# EAGLE design displayBoard (EAGLE 5.11)
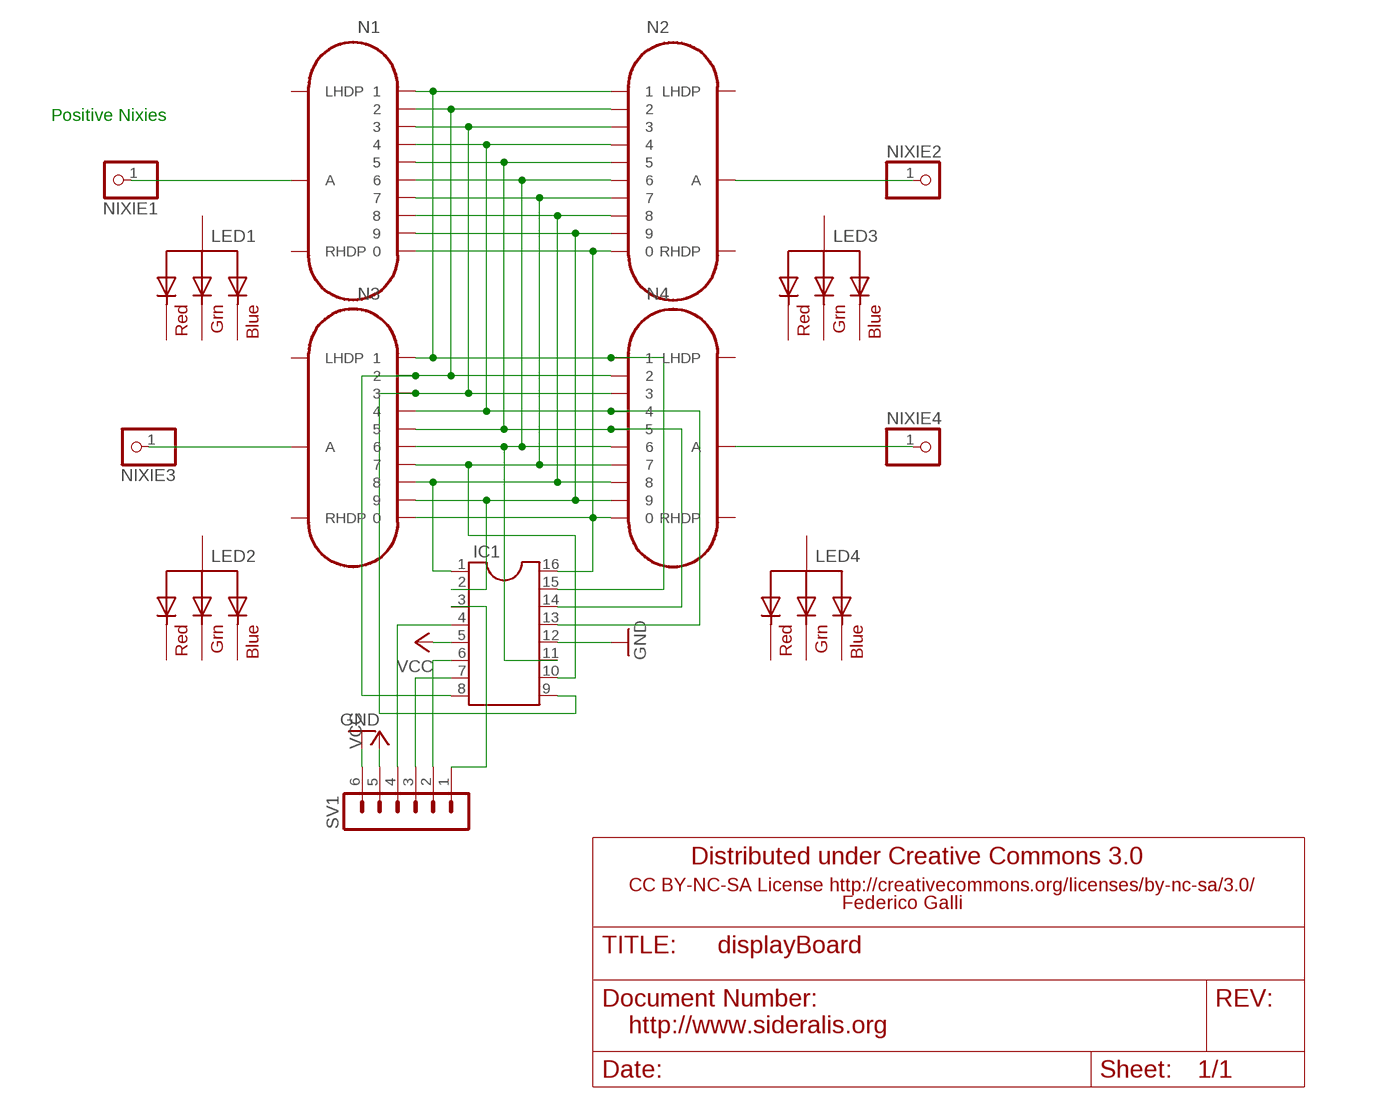
[diagram p0: schematic, sheet 1]

## Parts
IC1  DIL16  [DIL16]
LED1  RGBLED_CA-5MM  [LED5MMRGB]
LED2  RGBLED_CA-5MM  [LED5MMRGB]
LED3  RGBLED_CA-5MM  [LED5MMRGB]
LED4  RGBLED_CA-5MM  [LED5MMRGB]
N1  IN-14  [IN-14]
N2  IN-14  [IN-14]
N3  IN-14  [IN-14]
N4  IN-14  [IN-14]
NIXIE1  PINHD-1X1  [1X01]
NIXIE2  PINHD-1X1  [1X01]
NIXIE3  PINHD-1X1  [1X01]
NIXIE4  PINHD-1X1  [1X01]
SV1  MA06-1  [MA06-1]

## Nets
GND: IC1.12 SV1.6
N$1: IC1.2 N1.9 N2.9 N3.9 N4.9
N$2: IC1.15 N1.1 N2.1 N3.1 N4.1
N$6: N3.A NIXIE3.1
N$12: IC1.8 N1.2 N2.2 N3.2 N4.2
N$13: IC1.9 N1.3 N2.3 N3.3 N4.3
N$14: IC1.13 N1.4 N2.4 N3.4 N4.4
N$15: IC1.14 N1.5 N2.5 N3.5 N4.5
N$16: IC1.11 N1.6 N2.6 N3.6 N4.6
N$17: IC1.10 N1.7 N2.7 N3.7 N4.7
N$18: IC1.1 N1.8 N2.8 N3.8 N4.8
N$20: IC1.16 N1.0 N2.0 N3.0 N4.0
N$21: N1.A NIXIE1.1
N$31: N2.A NIXIE2.1
N$32: N4.A NIXIE4.1
N$35: IC1.3 SV1.1
N$36: IC1.6 SV1.2
N$37: IC1.7 SV1.3
N$38: IC1.4 SV1.4
VCC: IC1.5 SV1.5
Unconnected: LED1.1(RED) LED1.2(VCC) LED1.3(GREEN) LED1.4(BLUE) LED2.1(RED) LED2.2(VCC) LED2.3(GREEN) LED2.4(BLUE) LED3.1(RED) LED3.2(VCC) LED3.3(GREEN) LED3.4(BLUE) LED4.1(RED) LED4.2(VCC) LED4.3(GREEN) LED4.4(BLUE) N1.LHDP N1.RHDP N2.LHDP N2.RHDP N3.LHDP N3.RHDP N4.LHDP N4.RHDP

## Notes on the sheet
- Positive Nixies
- Distributed under Creative Commons 3.0
- CC BY-NC-SA License http://creativecommons.org/licenses/by-nc-sa/3.0/
- Federico Galli
- http://www.sideralis.org

## Library data of the parts
IC1 = ic-package:DIL16: Dual In Line / Socket
LED1-LED4 = adafruit:RGBLED_CA: RGB LED, common-anode 5MM Staggered pins 5mm Piranha package http://www.ladyada.net/library/pcb/eaglelibrary.html
N1-N4 = russian-nixies:IN-14: IN-14: medium numeric frontview nixie tube
NIXIE1-NIXIE4 = pinhead:PINHD-1X1: PIN HEADER
SV1 = con-lstb:MA06-1: PIN HEADER; OC_FARNELL: unknown; OC_NEWARK: unknown

## Net classes
0 default: width 0.051 mm, drill 0.051 mm, clearance 0.051 mm

## Board
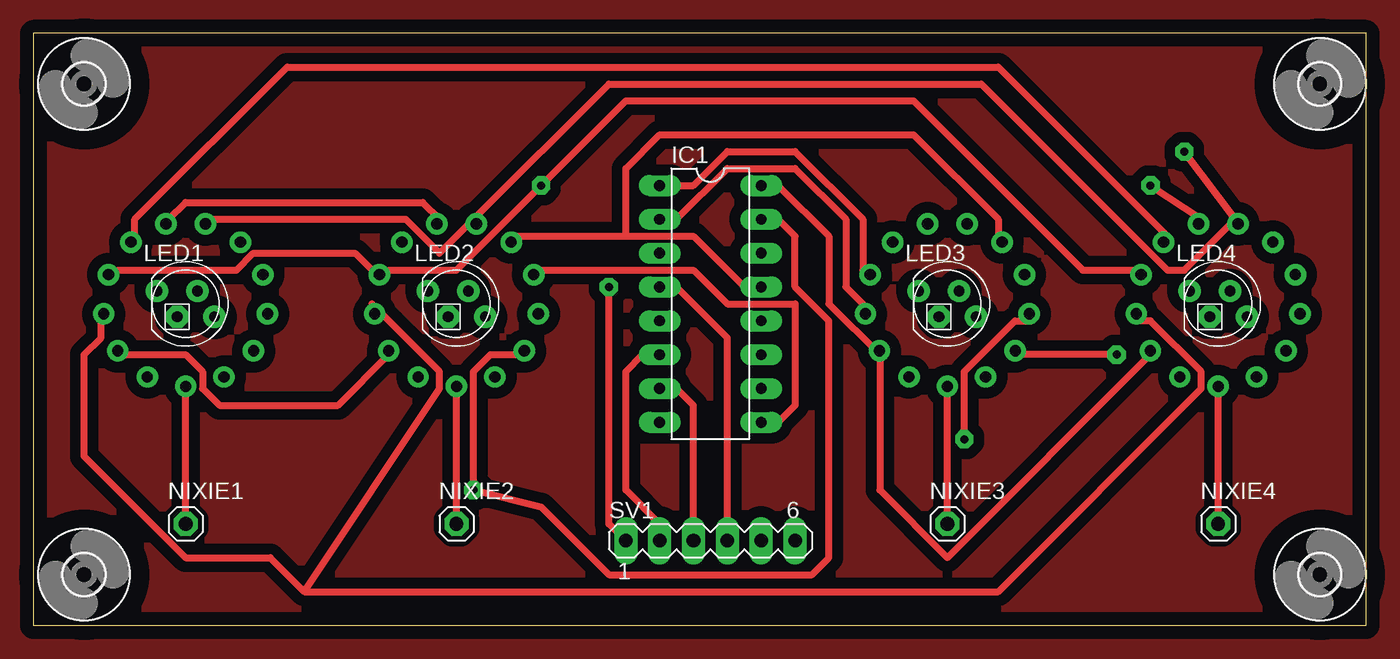
[diagram p1: board, top side]
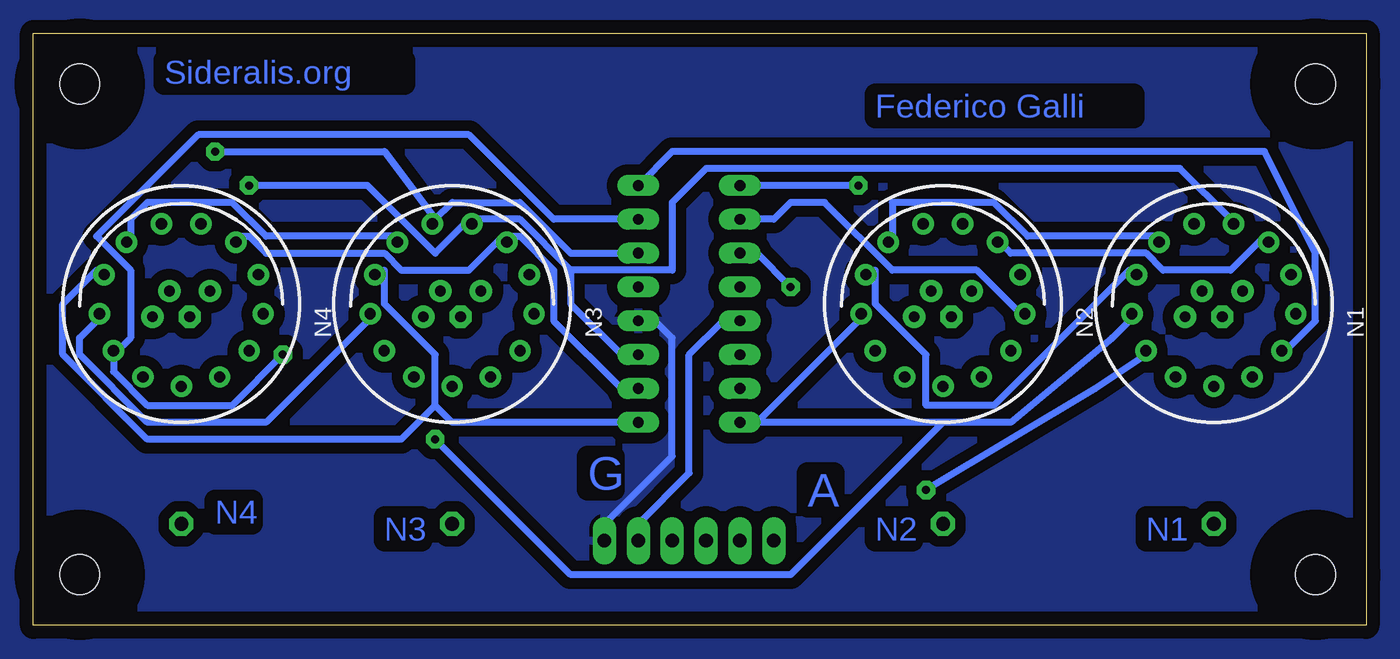
[diagram p2: board, bottom side, seen from below]

Size 100 x 44.44 mm. Coordinates in mm from the lower left corner, seen from the top.
Outline: 0,0 100,0 100,44.44 0,44.44 0,0
Copper layers (1*16): Top 0.035mm / dielectric 1.5mm / Bottom 0.035mm
Design rules "default *": minimum track width 20mil, minimum drill 24mil, track to track 8mil, track to pad 8mil, pad to pad 8mil, via to via 8mil, smd to smd 8mil, copper to edge 40mil, drill to drill 8mil, minimum pad ring 15mil, minimum via ring 15mil, stop-mask expansion 4mil, vias tented up to drill 0mil, thermal gap 10mil

### Footprints (pad centres in the part's own frame; a part is rotated, then mirrored left to right if it is on the bottom)
DIL16 = drill 0.813 long: 1 -8.89,-3.81; 2 -6.35,-3.81; 3 -3.81,-3.81; 4 -1.27,-3.81; 5 1.27,-3.81; 6 3.81,-3.81; 7 6.35,-3.81; 8 8.89,-3.81; 9 8.89,3.81; 10 6.35,3.81; 11 3.81,3.81; 12 1.27,3.81; 13 -1.27,3.81; 14 -3.81,3.81; 15 -6.35,3.81; 16 -8.89,3.81
LED5MMRGB = drill 0.8 pad 1.676 round: 1 -2.159,0.968; 3 0.889,0.968; 4 2.159,-0.968 | drill 0.8 pad 1.676 octagon: 2 -0.635,-0.968
IN-14 = drill 0.84 round: 0 5.094,-3.516; 1 -5.094,-3.516; 2 -6.145,-0.746; 3 -5.788,2.195; 4 -4.105,4.633; 5 -1.481,6.01; 6 1.481,6.01; 7 4.105,4.633; 8 5.788,2.195; 9 6.145,-0.746; A 0,-6.19; LHDP 2.877,-5.481; RHDP -2.877,-5.481
1X01 = drill 1.016 octagon: 1 0,0
MA06-1 = drill 1.016 long: 1 -6.35,0; 2 -3.81,0; 3 -1.27,0; 4 1.27,0; 5 3.81,0; 6 6.35,0
3,0 = hole 3: 0,0

### Placement (x,y rotation side)
IC1  50.8,24.13 270 top
LED1  11.43,24.13 0 top
LED2  31.75,24.13 0 top
LED3  68.58,24.13 0 top
LED4  88.9,24.13 0 top
N1  11.43,24.13 0 bottom
N2  31.75,24.13 0 bottom
N3  68.58,24.13 0 bottom
N4  88.9,24.13 0 bottom
NIXIE1  11.43,7.62 0 top
NIXIE2  31.75,7.62 0 top
NIXIE3  68.58,7.62 0 top
NIXIE4  88.9,7.62 0 top
SV1  50.8,6.35 0 top
U$1  [3,0]  3.81,40.64 0 top
U$2  [3,0]  96.52,40.64 0 top
U$3  [3,0]  96.52,3.81 0 top
U$4  [3,0]  3.81,3.81 0 top

### Tracks (layer width: path | path; a pad name or v marks a point on that pad's centre or on a via)
BOTTOM
  pour Bottom (isolate 0.813): -3.81,49.53 104.14,49.53 104.14,45.72 104.14,-6.35 -3.81,-6.35
GND
  Bottom 0.508: IC1.12 53.34,22.86 52.07,21.59 52.07,12.7 57.15,7.62 SV1.6
  pour Bottom (isolate 0.813): -2.54,49.53 102.87,48.26 102.87,-5.08 -2.54,-6.35
N$1
  Top 0.508: IC1.2 48.26,30.48 52.07,34.29 57.15,34.29 60.96,30.48 60.96,25.4 62.23,24.13 N3.9 | 20.32,2.54 30.48,17.78 30.48,19.05 25.4,24.13 N2.9 | 20.32,2.54 17.78,5.08 11.43,5.08 3.81,12.7 3.81,20.32 5.08,21.59 5.08,22.86 N1.9 | 20.32,2.54 72.39,2.54 87.63,17.78 87.63,19.05 83.82,22.86 82.55,22.86 N4.9
  Bottom 0.508: IC1.2 44.45,30.48 43.18,31.75 40.64,31.75 35.56,26.67 29.21,26.67 25.4,22.86 N2.9
N$2  (via drill 0.61)
  Top 0.508: N2.1 36.83,20.32 34.29,20.32 33.02,19.05 v33.02,10.16 38.1,8.89 43.18,3.81 58.42,3.81 59.69,5.08 59.69,22.86 57.15,25.4 57.15,29.21 55.88,30.48 IC1.15 | v81.28,20.32 73.66,20.32 N3.1
  Bottom 0.508: v33.02,10.16 20.32,17.78 16.51,20.32 N1.1 | IC1.15 60.96,30.48 67.31,36.83 87.63,36.83 95.25,29.21 92.71,26.67 92.71,21.59 93.98,20.32 | v81.28,20.32 85.09,16.51 91.44,16.51 93.98,19.05 93.98,20.32 | 93.98,20.32 N4.1
N$6
  Top 0.508: NIXIE3.1 N3.A
N$12  (via drill 0.61)
  Top 0.508: v69.85,13.97 69.85,19.05 73.66,22.86 74.93,22.86 N3.2
  Bottom 0.508: N3.2 74.93,22.86 82.55,15.24 91.44,15.24 96.52,20.32 96.52,21.59 95.25,22.86 N4.2 | 45.72,15.24 38.1,22.86 N2.2 | 31.75,15.24 45.72,15.24 | 31.75,15.24 26.67,15.24 19.05,21.59 17.78,22.86 N1.2 | 45.72,15.24 IC1.8 | v69.85,13.97 59.69,3.81 43.18,3.81 31.75,15.24
N$13
  Top 0.508: IC1.9 55.88,15.24 57.15,16.51 57.15,24.13 52.07,24.13 49.53,26.67 38.1,26.67 N2.3
  Bottom 0.508: N1.3 17.78,26.67 27.94,16.51 33.02,16.51 33.02,20.32 36.83,24.13 36.83,26.67 N2.3 | IC1.9 68.58,15.24 69.85,16.51 | 69.85,16.51 69.85,20.32 73.66,24.13 73.66,26.67 N3.3 | 69.85,16.51 72.39,13.97 91.44,13.97 97.79,20.32 97.79,24.13 95.25,26.67 N4.3
N$14
  Top 0.508: IC1.13 53.34,25.4 49.53,29.21 44.45,29.21 | 44.45,29.21 35.56,29.21 N2.4 | 44.45,29.21 44.45,34.29 46.99,36.83 66.04,36.83 72.39,30.48 72.39,29.21 N3.4
  Bottom 0.508: N3.4 72.39,29.21 82.55,29.21 85.09,31.75 91.44,31.75 92.71,30.48 92.71,29.21 N4.4 | N1.4 15.24,29.21 25.4,29.21 27.94,31.75 35.56,31.75 35.56,29.21 N2.4
N$15  (via drill 0.61)
  Top 0.508: 33.02,30.48 30.48,27.94 27.94,30.48 12.7,30.48 N1.5 | 90.17,30.48 v86.36,35.56 | 33.02,30.48 43.18,40.64 71.12,40.64 85.09,26.67 86.36,26.67 90.17,30.48 | 33.02,30.48 N2.5 | 90.17,30.48 N4.5
  Bottom 0.508: IC1.14 59.69,27.94 63.5,31.75 68.58,31.75 69.85,30.48 | v86.36,35.56 73.66,35.56 69.85,30.48 | 69.85,30.48 N3.5
N$16  (via drill 0.61)
  Top 0.508: N1.6 10.16,30.48 11.43,31.75 29.21,31.75 30.48,30.48 N2.6 | v83.82,33.02 87.63,30.48 N4.6
  Bottom 0.508: IC1.11 55.88,20.32 59.69,24.13 59.69,26.67 | 59.69,26.67 63.5,30.48 67.31,30.48 | v83.82,33.02 74.93,33.02 69.85,27.94 67.31,30.48 | 67.31,30.48 N3.6 | 59.69,26.67 52.07,26.67 52.07,31.75 49.53,34.29 13.97,34.29 10.16,30.48 N1.6
N$17
  Top 0.508: N1.7 7.62,29.21 7.62,30.48 19.05,41.91 72.39,41.91 85.09,29.21 N4.7
  Bottom 0.508: N1.7 7.62,29.21 10.16,26.67 15.24,26.67 16.51,27.94 26.67,27.94 27.94,29.21 N2.7 | IC1.10 55.88,17.78 60.96,22.86 60.96,26.67 63.5,29.21 64.77,29.21 | 64.77,29.21 67.31,26.67 72.39,26.67 73.66,27.94 82.55,27.94 83.82,29.21 85.09,29.21 N4.7 | 64.77,29.21 N3.7
N$18  (via drill 0.61)
  Top 0.508: IC1.1 49.53,33.02 52.07,35.56 57.15,35.56 62.23,30.48 62.23,26.67 N3.8 | N1.8 6.35,26.67 15.24,26.67 16.51,27.94 24.13,27.94 25.4,26.67 N2.8 26.67,26.67 31.75,26.67 v38.1,33.02 39.37,34.29 44.45,39.37 66.04,39.37 78.74,26.67 82.55,26.67 N4.8
  Bottom 0.508: v38.1,33.02 IC1.1
N$20
  Top 0.508: N1.0 6.35,20.32 11.43,20.32 12.7,19.05 12.7,17.78 13.97,16.51 22.86,16.51 26.67,20.32 N2.0 | IC1.16 55.88,33.02 59.69,29.21 59.69,24.13 63.5,20.32 | 63.5,20.32 63.5,10.16 68.58,5.08 83.82,20.32 N4.0 | 63.5,20.32 N3.0
  Bottom 0.508: IC1.16 52.07,35.56 7.62,35.56 3.81,27.94 3.81,22.86 6.35,20.32 N1.0
N$21
  Top 0.508: NIXIE1.1 N1.A
N$31
  Top 0.508: NIXIE2.1 N2.A
N$32
  Top 0.508: NIXIE4.1 N4.A
N$35  (via drill 0.61)
  Top 0.508: v43.18,25.4 43.18,7.62 SV1.1
  Bottom 0.508: IC1.3 45.72,27.94 v43.18,25.4
N$36
  Top 0.508: IC1.6 45.72,20.32 44.45,19.05 44.45,10.16 46.99,7.62 SV1.2
N$37
  Top 0.508: IC1.7 48.26,17.78 49.53,16.51 SV1.3
N$38
  Top 0.508: IC1.4 48.26,25.4 52.07,21.59 SV1.4
TOP
  pour Top (isolate 0.813): -2.54,48.26 -2.54,-5.08 102.87,-5.08 102.87,48.26
VCC
  Bottom 0.508: IC1.5 48.26,22.86 50.8,20.32 50.8,11.43 54.61,7.62 SV1.5

### Text on the board
Bottom: Sideralis.org | Federico Galli | G | A | N4 | N1 | N2 | N3